# EAGLE design BRICKER_SHEILD (EAGLE 9.6.2)
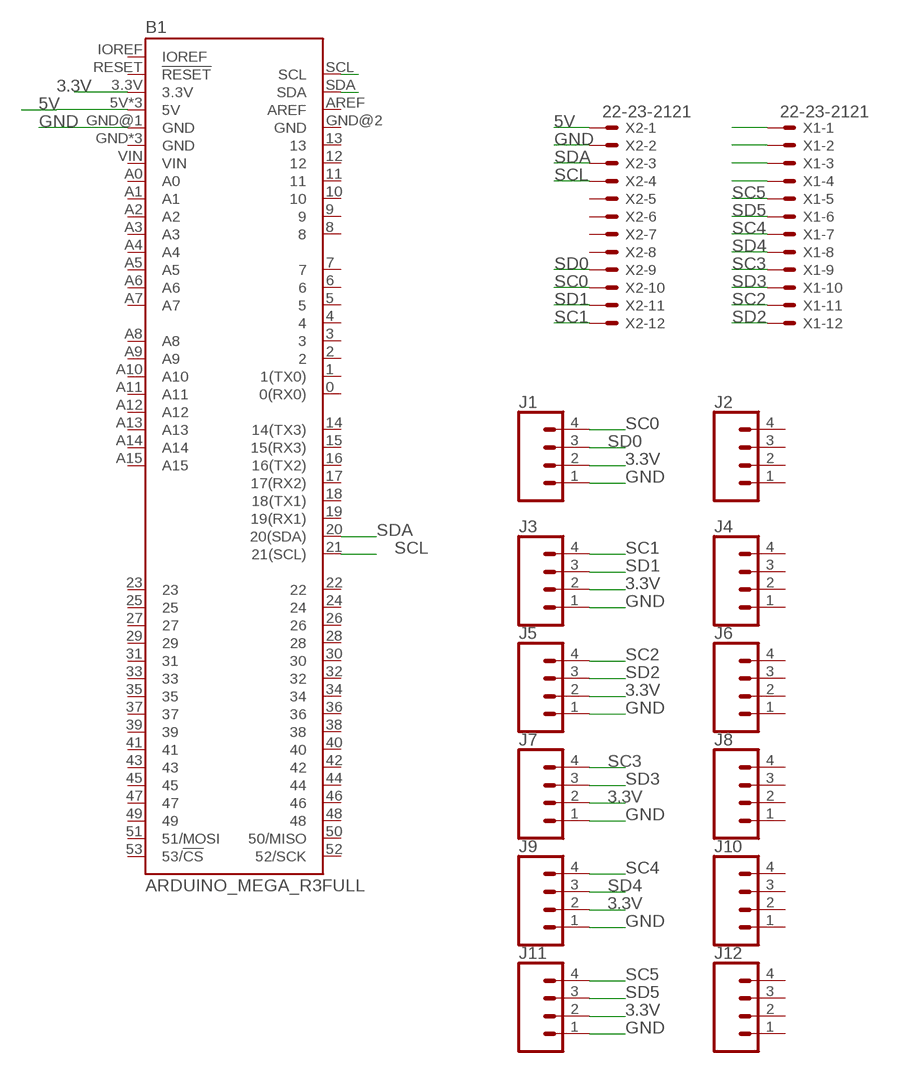
[diagram p0: schematic, sheet 1]

## Parts
B1  ARDUINO_MEGA_R3FULL  [ARDUINO_MEGA_NO_SILK]
J1  CONN_041X04_NO_SILK  [1X04_NO_SILK]
J2  CONN_041X04_NO_SILK  [1X04_NO_SILK]
J3  CONN_041X04_NO_SILK  [1X04_NO_SILK]
J4  CONN_041X04_NO_SILK  [1X04_NO_SILK]
J5  CONN_041X04_NO_SILK  [1X04_NO_SILK]
J6  CONN_041X04_NO_SILK  [1X04_NO_SILK]
J7  CONN_041X04_NO_SILK  [1X04_NO_SILK]
J8  CONN_041X04_NO_SILK  [1X04_NO_SILK]
J9  CONN_041X04_NO_SILK  [1X04_NO_SILK]
J10  CONN_041X04_NO_SILK  [1X04_NO_SILK]
J11  CONN_041X04_NO_SILK  [1X04_NO_SILK]
J12  CONN_041X04_NO_SILK  [1X04_NO_SILK]
X1  22-23-2121  [22-23-2121]
X2  22-23-2121  [22-23-2121]

## Nets
3.3V: B1.3.3V J1.2 J3.2 J5.2 J7.2 J9.2 J11.2
5V: B1.5V B1.5V@1(5V) B1.5V@2(5V) X2.1
GND: B1.GND@1(GND) J1.1 J3.1 J5.1 J7.1 J9.1 J11.1 X2.2
N$1: B1.SCL
N$17: X1.4
N$18: X1.3
N$19: X1.2
N$20: X1.1
N$24: B1.SDA
SC0: J1.4 X2.10
SC1: J3.4 X2.12
SC2: J5.4 X1.11
SC3: J7.4 X1.9
SC4: J9.4 X1.7
SC5: J11.4 X1.5
SCL: B1.21(21(SCL)) X2.4
SD0: J1.3 X2.9
SD1: J3.3 X2.11
SD2: J5.3 X1.12
SD3: J7.3 X1.10
SD4: J9.3 X1.8
SD5: J11.3 X1.6
SDA: B1.20(20(SDA)) X2.3
Unconnected: B1.0(0(RX0)) B1.1(1(TX0)) B1.2 B1.3 B1.4 B1.5 B1.6 B1.7 B1.8 B1.9 B1.10 B1.11 B1.12 B1.13 B1.14(14(TX3)) B1.15(15(RX3)) B1.16(16(TX2)) B1.17(17(RX2)) B1.18(18(TX1)) B1.19(19(RX1)) B1.22 B1.23 B1.24 B1.25 B1.26 B1.27 B1.28 B1.29 B1.30 B1.31 B1.32 B1.33 B1.34 B1.35 B1.36 B1.37 B1.38 B1.39 B1.40 B1.41 B1.42 B1.43 B1.44 B1.45 B1.46 B1.47 B1.48 B1.49 B1.50(50/MISO) B1.51(51/MOSI) B1.52(52/SCK) B1.53(53/!CS) B1.A0 B1.A1 B1.A2 B1.A3 B1.A4 B1.A5 B1.A6 B1.A7 B1.A8 B1.A9 B1.A10 B1.A11 B1.A12 B1.A13 B1.A14 B1.A15 B1.AREF B1.GND B1.GND@2(GND) B1.GND@3(GND) B1.GND@4(GND) B1.IOREF B1.RESET(!RESET) B1.VIN J2.1 J2.2 J2.3 J2.4 J4.1 J4.2 J4.3 J4.4 J6.1 J6.2 J6.3 J6.4 J8.1 J8.2 J8.3 J8.4 J10.1 J10.2 J10.3 J10.4 J12.1 J12.2 J12.3 J12.4 X2.5 X2.6 X2.7 X2.8

## Library data of the parts
B1 = SparkFun-Boards:ARDUINO_MEGA_R3: Arduino Mega R3 ATmega2560 R3 compatible footprint. SparkFun Products: Arduino Mega 2560 R3 <https://www.sparkfun.com/products/11061>
J1-J12 = SparkFun-Connectors:CONN_04: Multi connection point. Often used as Generic Header-pin footprint for 0.1 inch spaced/style header connections On any of the 0.1 inch spaced packages, you can populate with these: Break Away Headers - Straight <https://www.sparkfun.com/products/116> (PRT-00116) Break Away Male Headers - Right Angle <https://www.sparkfun.com/products/553> (PRT-00553) Female Headers <https://www.sparkfun.com/products/115> (PRT-00115) Break Away Headers - Machine Pin <https://www.sparkfun.com/products/117> (PRT-00117) Break Away Female Headers - Swiss Machine Pin <https://www.sparkfun.com/products/743> (PRT-00743) For SCREWTERMINALS and SPRING TERMINALS visit here: Screw Terimnals on SparkFun.com <https://www.sparkfun.com/search/results?term=Screw+Terminals> (5mm/3.5mm/2.54mm spacing) This device is also useful as a general connection point to wire up your design to another part of your project. Our various solder wires solder well into these plated through hole pads. Hook-Up Wire - Assortment (Stranded, 22 AWG) <https://www.sparkfun.com/products/11375> (PRT-11375) Hook-Up Wire - Assortment (Solid Core, 22 AWG) <https://www.sparkfun.com/products/11367> (PRT-11367) View the entire wire category on our website here <https://www.sparkfun.com/categories/141> Special notes: Molex polarized connector foot print use with SKU : PRT-08231 with associated crimp pins and housings. 1MM SMD Version SKU: PRT-10208; PROD_ID: CONN-09696
X1 X2 = con-molex:22-23-2121: .100" (2.54mm) Center Header - 12 Pin; MF: MOLEX; MPN: 22-23-2121; OC_FARNELL: 1462935; OC_NEWARK: 56H0456

## Board
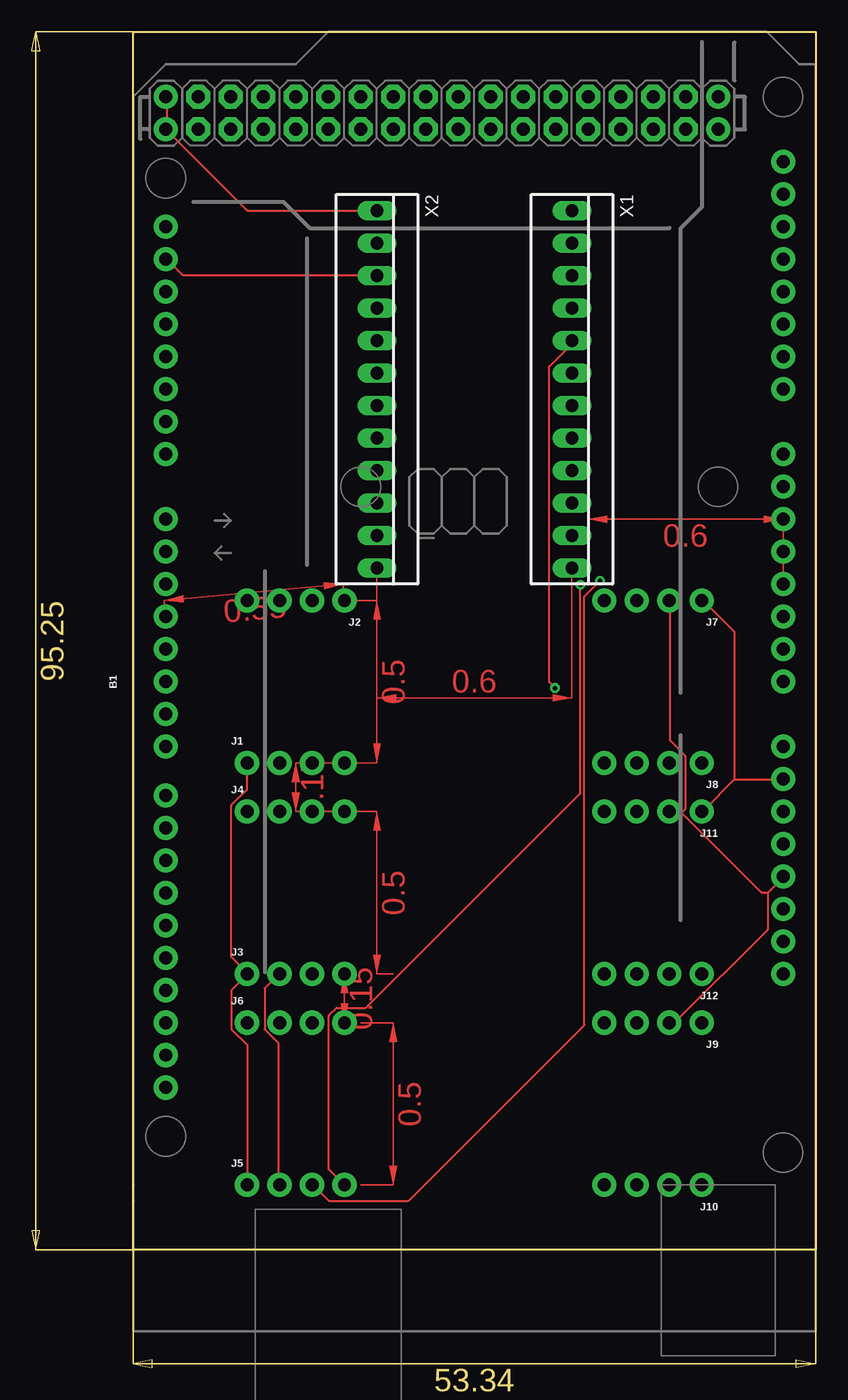
[diagram p1: board, top side]
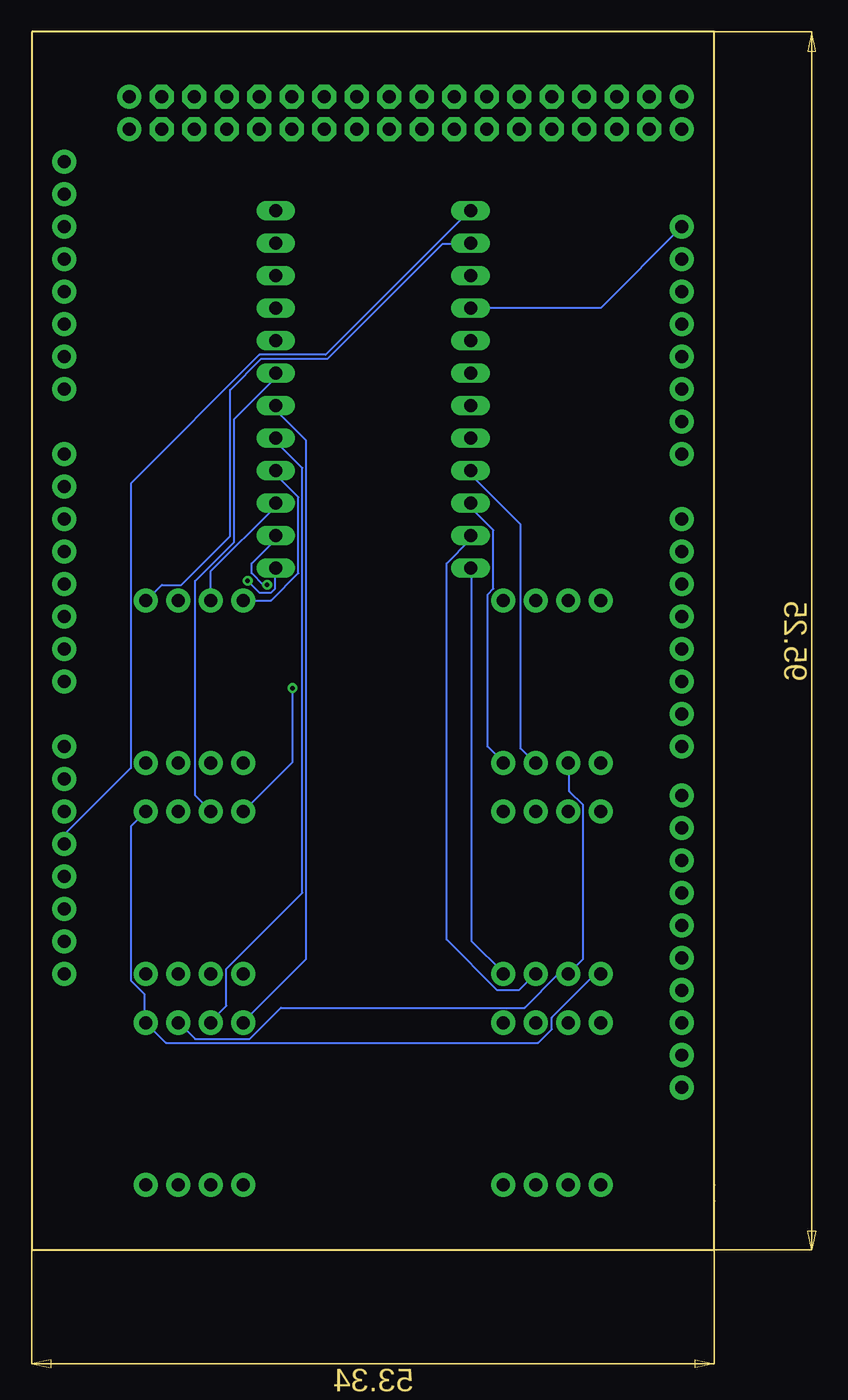
[diagram p2: board, bottom side, seen from below]

Size 53.34 x 95.25 mm. Coordinates in mm from the lower left corner, seen from the top.
Outline: 0,95.25 53.34,95.25 53.34,0 0,0 0,3.81 0,5.08 0,95.25
Copper layers (1*16): Top 0.035mm / dielectric 1.5mm / Bottom 0.035mm
Design rules "default": minimum track width 6mil, minimum drill 0.35mm, track to track 6mil, track to pad 6mil, pad to pad 6mil, via to via 6mil, smd to smd 6mil, copper to edge 40mil, drill to drill 6mil, minimum pad ring 10mil, minimum via ring 8mil, stop-mask expansion 4mil, vias tented up to drill 0mil, thermal gap 10mil

### Footprints (pad centres in the part's own frame; a part is rotated, then mirrored left to right if it is on the bottom)
ARDUINO_MEGA_NO_SILK = drill 1.016 pad 1.88: 0 13.97,24.13; 1 11.43,24.13; 2 8.89,24.13; 3 6.35,24.13; 3.3V -13.97,-24.13; 4 3.81,24.13; 5 1.27,24.13; 5V -11.43,-24.13; 5V@1 44.45,24.13; 5V@2 46.99,24.13; 6 -1.27,24.13; 7 -3.81,24.13; 8 -7.62,24.13; 9 -10.16,24.13; 10 -12.7,24.13; 11 -15.24,24.13; 12 -17.78,24.13; 13 -20.32,24.13; 14 19.05,24.13; 15 21.59,24.13; 16 24.13,24.13; 17 26.67,24.13; 18 29.21,24.13; 19 31.75,24.13; 20 34.29,24.13; 21 36.83,24.13; A0 1.27,-24.13; A1 3.81,-24.13; A2 6.35,-24.13; A3 8.89,-24.13; A4 11.43,-24.13; A5 13.97,-24.13; A6 16.51,-24.13; A7 19.05,-24.13; A8 24.13,-24.13; A9 26.67,-24.13; A10 29.21,-24.13; A11 31.75,-24.13; A12 34.29,-24.13; A13 36.83,-24.13; A14 39.37,-24.13; A15 41.91,-24.13; AREF -25.4,24.13; GND -8.89,-24.13; GND@1 -6.35,-24.13; GND@2 44.45,-19.05; GND@3 46.99,-19.05; GND@4 -22.86,24.13; IOREF -19.05,-24.13; NC -21.59,-24.13; RESET -16.51,-24.13; SCL -30.48,24.13; SDA -27.94,24.13; VIN -3.81,-24.13 | drill 1.016 pad 1.88 octagon: 22 44.45,21.59; 23 46.99,21.59; 24 44.45,19.05; 25 46.99,19.05; 26 44.45,16.51; 27 46.99,16.51; 28 44.45,13.97; 29 46.99,13.97; 30 44.45,11.43; 31 46.99,11.43; 32 44.45,8.89; 33 46.99,8.89; 34 44.45,6.35; 35 46.99,6.35; 36 44.45,3.81; 37 46.99,3.81; 38 44.45,1.27; 39 46.99,1.27; 40 44.45,-1.27; 41 46.99,-1.27; 42 44.45,-3.81; 43 46.99,-3.81; 44 44.45,-6.35; 45 46.99,-6.35; 46 44.45,-8.89; 47 46.99,-8.89; 48 44.45,-11.43; 49 46.99,-11.43; 50 44.45,-13.97; 51 46.99,-13.97; 52 44.45,-16.51; 53 46.99,-16.51
1X04_NO_SILK = drill 1.016 pad 1.88: 1 0,0; 2 2.54,0; 3 5.08,0; 4 7.62,0
22-23-2121 = drill 1 long: 1 -13.97,0; 2 -11.43,0; 3 -8.89,0; 4 -6.35,0; 5 -3.81,0; 6 -1.27,0; 7 1.27,0; 8 3.81,0; 9 6.35,0; 10 8.89,0; 11 11.43,0; 12 13.97,0

### Placement (x,y rotation side)
B1  26.67,43.18 90 top
J1  8.89,38.1 0 top
J2  16.51,50.8 180 top
J3  8.89,21.59 0 top
J4  8.89,34.29 0 top
J5  8.89,5.08 0 top
J6  8.89,17.78 0 top
J7  44.45,50.8 180 top
J8  44.45,38.1 180 top
J9  44.45,17.78 180 top
J10  44.45,5.08 180 top
J11  44.45,34.29 180 top
J12  44.45,21.59 180 top
X1  34.29,67.31 270 top
X2  19.05,67.31 270 top

### Tracks (layer width: path | path; a pad name or v marks a point on that pad's centre or on a via)
3.3V
  Top 0.152: J5.2 11.33,5.08 11.33,16.2 10.26,17.27 10.26,20.47 11.33,21.54 J3.2 | 49.58,27.94 49.58,25.04 42.42,17.88 41.96,17.88 J9.2 | 49.58,27.94 50.8,29.16 B1.3.3V | 42.88,34.19 41.96,34.19 J11.2 | 42.88,34.19 49.12,27.94 49.58,27.94 | 42.88,34.19 43.18,34.49 43.18,38.61 41.96,39.83 41.96,50.8 J7.2
  Bottom 0.152: J1.2 11.33,38 11.33,35.87 10.26,34.8 10.26,22.76 J3.2 11.48,21.54 12.24,21.54 14.83,18.95 33.88,18.95 36.32,16.51 40.59,16.51 41.81,17.73 J9.2
5V
  Top 0.152: X2.1 8.89,81.28 B1.5V@1 2.64,87.68 2.64,90.12 B1.5V@2
  Bottom 0.152: B1.5V 50.8,32.51 45.62,37.69 45.62,59.94 35.56,70 30.38,70 19.1,81.28 X2.1
GND
  Top 0.152: J5.1 8.89,16.05 7.67,17.27 7.67,20.32 8.89,21.54 J3.1 8.89,21.69 7.67,22.91 7.67,34.8 8.89,36.02 J1.1 | 46.99,36.78 50.8,36.78 B1.GND@1 | 46.99,36.78 44.55,34.34 J11.1 | 46.99,36.78 46.99,48.36 44.55,50.8 J7.1
  Bottom 0.152: J11.1 45.62,33.12 45.62,21.08 44.55,20.02 44.55,17.88 J9.1 42.88,16.2 13.77,16.2 12.7,17.27 12.7,18.19 9.35,21.54 8.89,21.54 J3.1 | X2.2 19.1,78.69 21.23,78.69 30.23,69.7 35.41,69.7 37.85,67.26 37.85,55.83 41.66,52.02 43.18,52.02 44.4,50.8 J7.1
SC0
  Bottom 0.152: X2.10 18.95,58.42 18.95,57.96 17.27,56.29 17.27,51.71 17.73,51.26 17.73,39.37 16.51,38.15 J1.4
SC1
  Bottom 0.152: X2.12 18.95,53.24 18.95,24.13 16.51,21.69 J3.4
SC2  (via drill 0.35)
  Top 0.152: v34.95,52.02 34.95,35.71 18.19,18.95 15.9,18.95 15.29,18.34 15.29,6.3 J5.4
  Bottom 0.152: v34.95,52.02 35.25,52.02 36.17,52.93 36.17,53.7 34.34,55.52 34.34,55.83 X1.11
SC3
  Bottom 0.152: J7.4 34.65,50.8 32.51,52.93 32.51,58.88 34.19,60.55 34.19,60.86 X1.9
SC4
  Bottom 0.152: X1.7 34.19,66.04 34.19,65.58 31.9,63.3 31.9,22.76 36.78,17.88 J9.4
SC5  (via drill 0.35)
  Top 0.152: v32.97,43.94 32.51,44.4 32.51,69.09 34.19,70.76 34.19,71.07 X1.5
  Bottom 0.152: v32.97,43.94 32.97,38.15 J11.4
SCL
  Bottom 0.152: X2.4 8.89,73.66 B1.21
SD0
  Bottom 0.152: X2.9 18.95,60.86 18.95,60.55 15.14,56.74 15.14,39.22 14.07,38.15 J1.3
SD1
  Bottom 0.152: X2.11 19.1,55.83 19.1,55.52 20.93,53.7 20.93,24.28 16.97,20.32 15.29,20.32 14.07,21.54 J3.3
SD2  (via drill 0.35)
  Top 0.152: v36.47,52.32 35.25,51.11 35.25,17.58 21.54,3.86 15.29,3.86 14.07,5.08 J5.3
  Bottom 0.152: v36.47,52.32 35.56,51.41 34.65,51.41 34.34,51.71 34.34,53.24 X1.12
SD3
  Bottom 0.152: J7.3 39.37,53.09 34.34,58.12 34.34,58.42 X1.10
SD4
  Bottom 0.152: X1.8 34.19,63.45 34.19,63.14 32.21,61.16 32.21,27.94 38.15,22 38.15,19.1 39.37,17.88 J9.3
SD5
  Bottom 0.152: X1.6 34.34,68.48 34.34,68.17 37.54,64.97 37.54,55.37 40.59,52.32 40.59,35.56 39.37,34.34 J11.3
SDA
  Top 0.152: X2.3 18.95,76.25 3.86,76.25 2.64,77.47 B1.20
(copper drawn outside any net)
  shapes: Top area x8